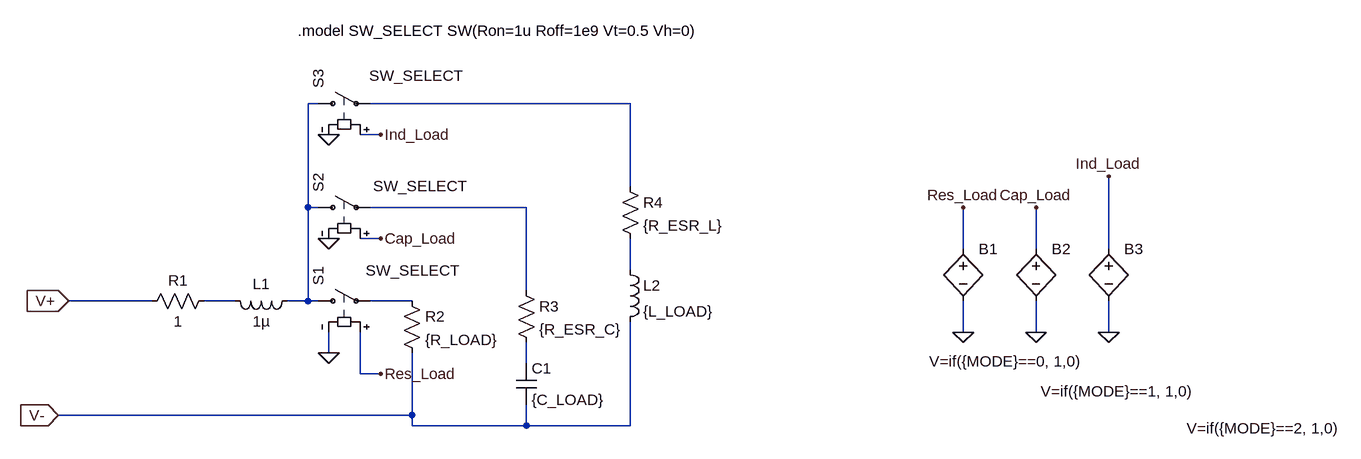
[diagram p0: schematic Carga_Bat.asc]
Carga_Bat.asc, the LTspice schematic file:
Version 4
SHEET 1 2260 680
WIRE 448 -240 432 -240
WIRE 928 -240 528 -240
WIRE 544 -192 512 -192
WIRE 928 -112 928 -240
WIRE 432 -80 432 -240
WIRE 448 -80 432 -80
WIRE 768 -80 528 -80
WIRE 544 -32 512 -32
WIRE 1440 -16 1440 -80
WIRE 1552 -16 1552 -80
WIRE 1664 -16 1664 -128
WIRE 928 16 928 -32
WIRE 768 48 768 -80
WIRE 192 64 64 64
WIRE 320 64 272 64
WIRE 432 64 432 -80
WIRE 432 64 400 64
WIRE 448 64 432 64
WIRE 592 64 528 64
WIRE 1440 112 1440 64
WIRE 1552 112 1552 64
WIRE 1664 112 1664 64
WIRE 464 144 464 112
WIRE 768 160 768 128
WIRE 512 176 512 112
WIRE 544 176 512 176
WIRE 592 240 592 144
WIRE 592 240 48 240
WIRE 592 256 592 240
WIRE 768 256 768 224
WIRE 768 256 592 256
WIRE 928 256 928 96
WIRE 928 256 768 256
FLAG 64 64 V+
IOPIN 64 64 In
FLAG 48 240 V-
IOPIN 48 240 In
FLAG 1440 112 0
FLAG 1552 112 0
FLAG 1664 112 0
FLAG 1440 -80 Res_Load
FLAG 1552 -80 Cap_Load
FLAG 1664 -128 Ind_Load
FLAG 544 176 Res_Load
FLAG 464 144 0
FLAG 464 -32 0
FLAG 544 -32 Cap_Load
FLAG 544 -192 Ind_Load
FLAG 464 -192 0
SYMBOL res 288 48 R90
WINDOW 0 0 56 VBottom 2
WINDOW 3 32 56 VTop 2
SYMATTR InstName R1
SYMATTR Value 1
SYMBOL ind 416 48 R90
WINDOW 0 5 56 VBottom 2
WINDOW 3 32 56 VTop 2
SYMATTR InstName L1
SYMATTR Value 1µ
SYMBOL res 576 48 R0
SYMATTR InstName R2
SYMATTR Value {R_LOAD}
SYMBOL sw 432 64 R270
WINDOW 3 47 89 VRight 2
SYMATTR Value SW_SELECT
SYMATTR InstName S1
SYMBOL sw 432 -80 R270
WINDOW 3 33 100 VRight 2
SYMATTR Value SW_SELECT
SYMATTR InstName S2
SYMBOL sw 432 -240 R270
WINDOW 3 43 94 VRight 2
SYMATTR Value SW_SELECT
SYMATTR InstName S3
SYMBOL res 752 32 R0
SYMATTR InstName R3
SYMATTR Value {R_ESR_C}
SYMBOL cap 752 160 R0
SYMATTR InstName C1
SYMATTR Value {C_LOAD}
SYMATTR SpiceLine IC={V_INIT}
SYMBOL res 912 -128 R0
SYMATTR InstName R4
SYMATTR Value {R_ESR_L}
SYMBOL ind 912 0 R0
SYMATTR InstName L2
SYMATTR Value {L_LOAD}
SYMBOL bv 1440 -32 R0
WINDOW 3 -52 189 Left 2
SYMATTR Value V=if({MODE}==0, 1,0)
SYMATTR InstName B1
SYMBOL bv 1552 -32 R0
WINDOW 3 7 235 Left 2
SYMATTR Value V=if({MODE}==1, 1,0)
SYMATTR InstName B2
SYMBOL bv 1664 -32 R0
WINDOW 3 120 292 Left 2
SYMATTR Value V=if({MODE}==2, 1,0)
SYMATTR InstName B3
TEXT 416 -352 Left 2 !.model SW_SELECT SW(Ron=1u Roff=1e9 Vt=0.5 Vh=0)

The netlist it stands for:
* Carga_Bat.asc
R1 N005 V+ 1
L1 N001 N005 1µ
R2 N006 V- {R_LOAD}
S1 N001 N006 Res_Load 0 SW_SELECT
S2 N001 N003 Cap_Load 0 SW_SELECT
S3 N001 N002 Ind_Load 0 SW_SELECT
R3 N003 N007 {R_ESR_C}
C1 N007 V- {C_LOAD} IC={V_INIT}
R4 N002 N004 {R_ESR_L}
L2 N004 V- {L_LOAD}
B1 Res_Load 0 V=if({MODE}==0, 1,0)
B2 Cap_Load 0 V=if({MODE}==1, 1,0)
B3 Ind_Load 0 V=if({MODE}==2, 1,0)
.model SW_SELECT SW(Ron=1u Roff=1e9 Vt=0.5 Vh=0)
.backanno
.end